# EAGLE design ring-modulator-v2.0 (EAGLE 9.5.2)
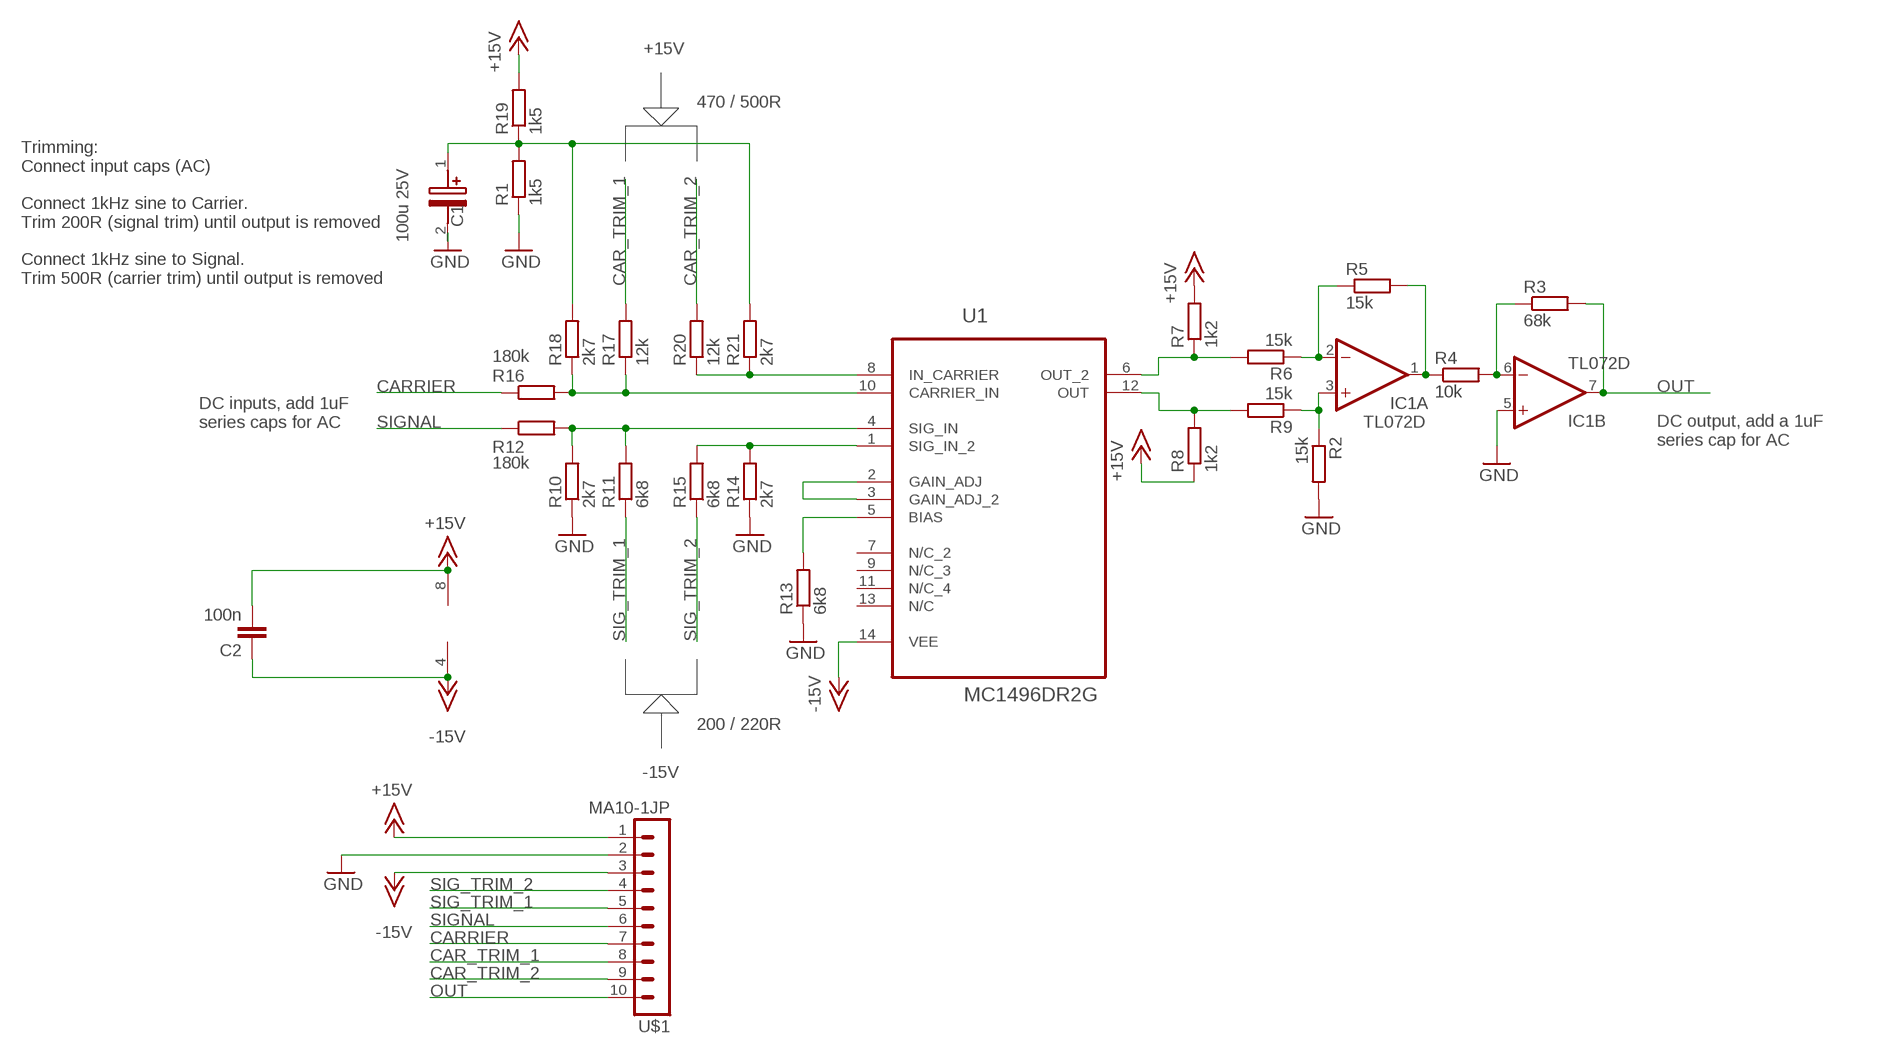
[diagram p0: schematic, sheet 1]

## Parts
C1  100u 25V  VZL101M1CTR-0606  [CAPAE660X610N]
C2  100n  C-EUC0603  [C0603]
IC1  TL072D  [SO08J]
R1  1k5  R-EU_R0805  [R0805]
R2  15k  R-EU_R0805  [R0805]
R3  68k  R-EU_R0805  [R0805]
R4  10k  R-EU_R0805  [R0805]
R5  15k  R-EU_R0805  [R0805]
R6  15k  R-EU_R0805  [R0805]
R7  1k2  R-EU_R0805  [R0805]
R8  1k2  R-EU_R0805  [R0805]
R9  15k  R-EU_R0805  [R0805]
R10  2k7  R-EU_R0805  [R0805]
R11  6k8  R-EU_R0805  [R0805]
R12  180k  R-EU_R0805  [R0805]
R13  6k8  R-EU_R0805  [R0805]
R14  2k7  R-EU_R0805  [R0805]
R15  6k8  R-EU_R0805  [R0805]
R16  180k  R-EU_R0805  [R0805]
R17  12k  R-EU_R0805  [R0805]
R18  2k7  R-EU_R0805  [R0805]
R19  1k5  R-EU_R0805  [R0805]
R20  12k  R-EU_R0805  [R0805]
R21  2k7  R-EU_R0805  [R0805]
U1  MC1496DR2G  [SOIC127P600X175-14N]
U$1  MA10-1JP  [SIP-PIN10-1J]

## Nets
+15V: C2.2 IC1.8(P:V+) R7.2 R8.1 R19.2 U$1.1
-15V: C2.1 IC1.4(P:V-) U1.14(VEE) U$1.3
CAR_TRIM_1: R17.2 U$1.8
CAR_TRIM_2: R20.2 U$1.9
CARRIER: R16.1 U$1.7
GND: C1.2(-) IC1.5(B:+IN) R1.1 R2.2 R10.1 R13.1 R14.1 U$1.2
N$1: R10.2 R11.2 R12.2 U1.4(SIG_IN)
N$2: R16.2 R17.1 R18.1 U1.10(CARRIER_IN)
N$3: R14.2 R15.2 U1.1(SIG_IN_2)
N$8: R20.1 R21.1 U1.8(IN_CARRIER)
N$9: C1.1(+) R1.2 R18.2 R19.1 R21.2
N$11: R13.2 U1.5(BIAS)
N$12: U1.2(GAIN_ADJ) U1.3(GAIN_ADJ_2)
N$13: R6.2 R7.1 U1.6(OUT_2)
N$14: R8.2 R9.2 U1.12(OUT)
N$15: IC1.3(A:+IN) R2.1 R9.1
N$16: IC1.2(A:-IN) R5.1 R6.1
N$17: IC1.1(A:OUT) R4.1 R5.2
N$18: IC1.6(B:-IN) R3.1 R4.2
OUT: IC1.7(B:OUT) R3.2 U$1.10
SIG_TRIM_1: R11.1 U$1.5
SIG_TRIM_2: R15.1 U$1.4
SIGNAL: R12.1 U$1.6
Unconnected: U1.7(N/C_2) U1.9(N/C_3) U1.11(N/C_4) U1.13(N/C)

## Notes on the sheet
- +15V
- 470 / 500R
- Trimming:
  Connect input caps (AC)
  
  Connect 1kHz sine to Carrier. 
  Trim 200R (signal trim) until output is removed
  
  Connect 1kHz sine to Signal. 
  Trim 500R (carrier trim) until output is removed
- DC inputs, add 1uF 
  series caps for AC
- DC output, add a 1uF 
  series cap for AC
- 200 / 220R
- -15V

## Library data of the parts
C1 = joakim-jclpcb:VZL101M1CTR-0606: Aluminum Electrolytic Capacitors - SMD 100uF 16 Volts 20% Source: Datasheet <https://www.mouser.com/datasheet/2/231/151002386372-1222327.pdf>; DESCRIPTION: Aluminum Electrolytic Capacitors - SMD 100uF 16 Volts 20%; HEIGHT: 6.1mm; MANUFACTURER_NAME: Lelon; MANUFACTURER_PART_NUMBER: VZL101M1CTR-0606; MOUSER_PART_NUMBER: 140-VZL101M1CTR-0606; MOUSER_PRICE-STOCK: https://www.mouser.com/Search/Refine.aspx?Keyword=140-VZL101M1CTR-0606
C2 = rcl:C-EU: CAPACITOR, European symbol; SPICEPREFIX: C
IC1 = joakim:TL072: OP AMP
R1-R21 = resistor:R-EU_: RESISTOR, European symbol
U1 = ON Semiconductor_By_element14_Batch_1:MC1496DR2G: Balanced Modulators/Demodulators; MPN: MC1496DR2G; OC_FARNELL: 1651904; OC_NEWARK: 45J1148; PACKAGE: SOIC-14; SUPPLIER: ON SEMICONDUCTOR
U$1 = joakim:MA10-1J

## Board
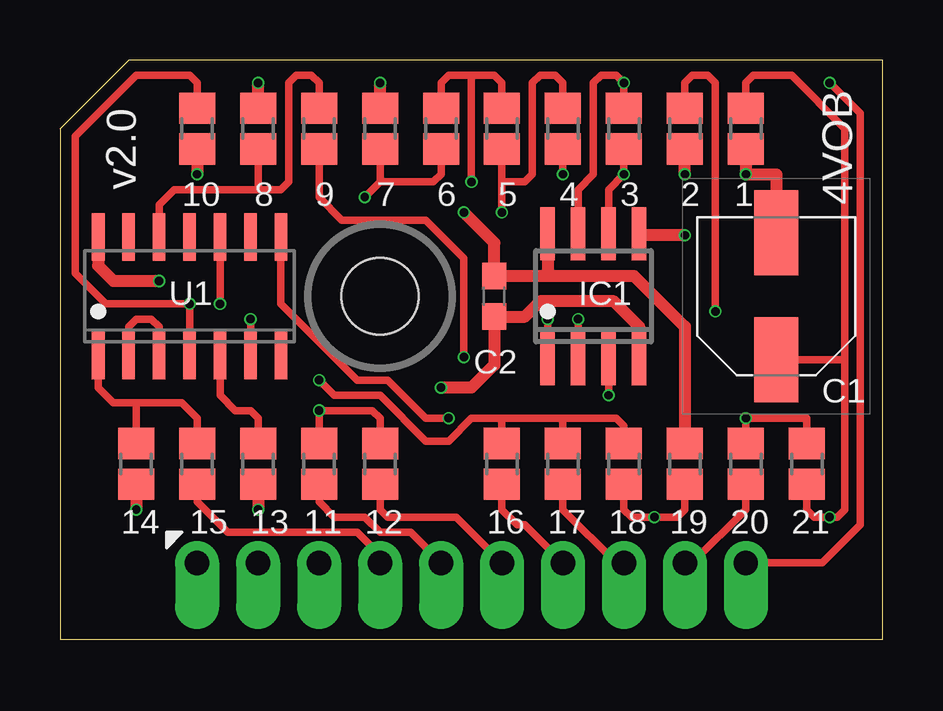
[diagram p1: board, top side]
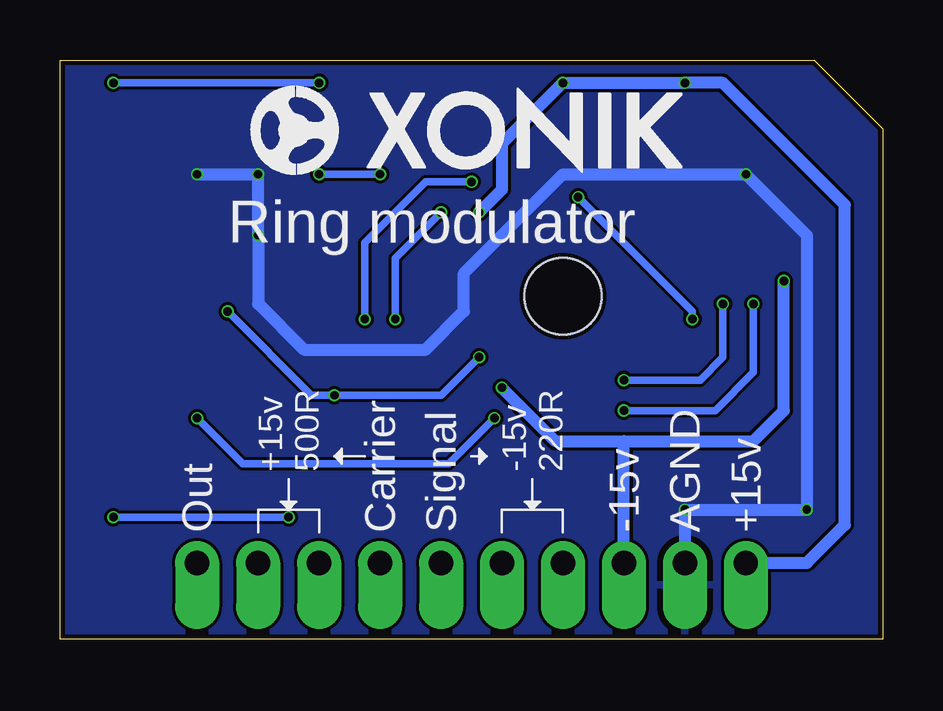
[diagram p2: board, bottom side, seen from below]

Size 34.29 x 24.13 mm. Coordinates in mm from the lower left corner, seen from the top.
Outline: 0,0 34.29,0 34.29,24.13 2.86,24.13 0,21.27 0,0
Copper layers (1*16): Top 0.035mm / dielectric 1.6mm / Bottom 0.035mm
Design rules "jlcpcb-2layers": minimum track width 5mil, minimum drill 0.3mm, track to track 5mil, track to pad 5mil, pad to pad 5mil, via to via 5mil, smd to smd 5mil, copper to edge 0.2mm, drill to drill 6mil, minimum pad ring 10mil, minimum via ring 3mil, stop-mask expansion 4mil, vias tented up to drill 0mil, thermal gap 10mil
Holes 3.2 mm at 13.34,14.29

### Footprints (pad centres in the part's own frame; a part is rotated, then mirrored left to right if it is on the bottom)
CAPAE660X610N = smd 3.55 x 1.85: 1 -2.65,0; 2 2.65,0
C0603 = smd 1.1 x 1: 1 -0.85,0; 2 0.85,0
SO08J = smd 0.6 x 2.2: 1 -1.905,-2.6; 2 -0.635,-2.6; 3 0.635,-2.6; 4 1.905,-2.6; 5 1.905,2.6; 6 0.635,2.6; 7 -0.635,2.6; 8 -1.905,2.6
R0805 = smd 1.3 x 1.5: 1 -0.85,0; 2 0.85,0
SOIC127P600X175-14N = smd 1.981 x 0.533: 1 -2.464,3.81; 2 -2.464,2.54; 3 -2.464,1.27; 4 -2.464,0; 5 -2.464,-1.27; 6 -2.464,-2.54; 7 -2.464,-3.81; 8 2.464,-3.81; 9 2.464,-2.54; 10 2.464,-1.27; 11 2.464,0; 12 2.464,1.27; 13 2.464,2.54; 14 2.464,3.81
SIP-PIN10-1J = drill 1.016 offset: 1 -11.43,0; 2 -8.89,0; 3 -6.35,0; 4 -3.81,0; 5 -1.27,0; 6 1.27,0; 7 3.81,0; 8 6.35,0; 9 8.89,0; 10 11.43,0

### Placement (x,y rotation side)
C1  29.84,14.29 90 top
C2  18.1,14.29 90 top
IC1  22.23,14.29 0 top
R1  28.57,21.27 90 top
R2  26.04,21.27 270 top
R3  23.5,21.27 90 top
R4  20.95,21.27 270 top
R5  18.41,21.27 270 top
R6  15.88,21.27 270 top
R7  13.34,21.27 90 top
R8  8.26,21.27 270 top
R9  10.79,21.27 90 top
R10  5.71,21.27 90 top
R11  10.79,7.3 90 top
R12  13.34,7.3 90 top
R13  8.26,7.3 90 top
R14  3.17,7.3 90 top
R15  5.71,7.3 90 top
R16  18.41,7.3 90 top
R17  20.95,7.3 270 top
R18  23.5,7.3 270 top
R19  26.04,7.3 90 top
R20  28.57,7.3 270 top
R21  31.11,7.3 270 top
U1  5.4,14.29 90 top
U$1  17.14,3.17 0 top
U$3  [XONIK_LOGO_18]  26.35,19.37 0 bottom

### Tracks (layer width: path | path; a pad name or v marks a point on that pad's centre or on a via)
+15V  (via drill 0.35)
  Top 0.508: R19.2 26.04,13.02 23.91,15.14 20.32,15.14 | R8.1 v8.26,23.18 | R7.2 v13.34,23.18 | 20.32,15.14 C2.2 18.1,16.51 v16.83,17.78 | IC1.8 20.32,15.14
  Bottom 0.508: U$1.1 3.17,3.17 1.59,4.76 1.59,18.1 6.67,23.18 v8.26,23.18 v13.34,23.18 15.88,20.64 15.88,18.73 v16.83,17.78
-15V  (via drill 0.35)
  Top 0.508: U1.14 1.59,15.56 2.22,14.92 v4.13,14.92 | IC1.4 24.13,13.02 23.07,14.07 20,14.07 19.37,13.44 C2.1 18.1,11.43 17.14,10.48 v15.88,10.48
  Bottom 0.508: U$1.3 10.79,8.26 | v4.13,14.92 4.13,9.53 5.4,8.26 10.79,8.26 | v15.88,10.48 13.65,8.26 10.79,8.26
CAR_TRIM_1
  Top 0.305: R17.2 20.95,5.4 23.18,3.17 U$1.8
CAR_TRIM_2
  Top 0.305: R20.2 28.57,5.4 26.35,3.17 U$1.9
CARRIER
  Top 0.305: R16.1 18.41,5.4 19.05,4.76 19.37,4.76 U$1.7
GND  (via drill 0.35)
  Top 0.508: v26.04,16.83 24.19,16.83 IC1.5 | R14.1 v3.17,5.4 | R13.1 v8.26,5.4 | R10.1 v5.71,19.37 | v26.04,19.37 R2.2 | R1.1 v28.57,19.37 29.84,19.37 C1.2
  Bottom 0.508: U$1.2 v8.26,5.4 v3.17,5.4 3.17,16.83 v5.71,19.37 13.34,19.37 17.46,15.24 17.46,13.65 19.05,12.06 24.13,12.06 26.04,13.97 v26.04,16.83 v26.04,19.37 v28.57,19.37
  pour Bottom: 34.29,24.13 0,24.13 0,0 34.29,0
N$1  (via drill 0.35)
  Top 0.305: R11.2 v10.79,9.53 13.02,9.53 13.34,9.21 R12.2 | U1.4 v5.4,13.97 1.91,13.97 0.64,15.24 0.64,20.95 3.17,23.5 5.4,23.5 5.71,23.18 R10.2
  Bottom 0.305: v5.4,13.97 5.4,11.11 6.99,9.53 v10.79,9.53
N$2  (via drill 0.35)
  Top 0.305: 18.41,9.21 R16.2 | 18.41,9.21 20.95,9.21 | R17.1 20.95,9.21 | 18.41,9.21 17.14,9.21 16.19,8.26 15.24,8.26 13.34,10.16 11.43,10.16 v10.79,10.79 | R18.1 23.5,8.89 23.18,9.21 20.95,9.21 | U1.10 v6.67,13.97
  Bottom 0.305: v6.67,13.97 6.67,11.75 7.62,10.79 v10.79,10.79
N$3
  Top 0.305: U1.1 1.59,10.48 2.22,9.84 3.17,9.84 | 3.17,9.84 5.08,9.84 5.71,9.21 R15.2 | R14.2 3.17,9.84
N$8  (via drill 0.35)
  Top 0.305: U1.8 9.21,13.97 12.38,10.79 13.65,10.79 15.24,9.21 v16.19,9.21 | R20.1 v28.57,9.21 31.11,9.21 R21.1
  Bottom 0.305: v28.57,9.21 26.67,7.3 18.1,7.3 v16.19,9.21
N$9  (via drill 0.35)
  Top 0.305: 32.7,11.75 32.7,5.4 32.38,5.08 v32.07,5.08 31.43,5.08 31.11,5.4 R21.2 | 32.7,11.75 32.7,21.27 30.48,23.5 28.89,23.5 28.57,23.18 R1.2 | 32.7,11.75 32.59,11.64 C1.1 | R18.2 23.5,5.4 23.81,5.08 v24.77,5.08 25.72,5.08 26.04,5.4 R19.1
  Bottom 0.305: v32.07,5.08 v24.77,5.08
N$11
  Top 0.305: U1.5 6.67,10.16 7.3,9.53 7.94,9.53 8.26,9.21 R13.2
N$12
  Top 0.305: U1.2 2.86,13.02 3.17,13.34 3.81,13.34 4.13,13.02 U1.3
N$13  (via drill 0.35)
  Top 0.305: U1.6 v7.94,13.34 | 13.34,19.05 v12.7,18.41 | R6.2 15.88,19.37 15.56,19.05 13.34,19.05 | R7.1 13.34,19.05
  Bottom 0.305: v7.94,13.34 7.94,13.65 v12.7,18.41
N$14
  Top 0.305: U1.12 4.13,18.1 4.76,18.73 8.26,18.73 | R9.2 10.79,23.18 10.48,23.5 9.84,23.5 9.53,23.18 9.53,19.05 9.21,18.73 8.26,18.73 | R8.2 8.26,18.73
N$15  (via drill 0.35)
  Top 0.305: R9.1 10.79,18.41 11.75,17.46 15.24,17.46 16.83,15.88 v16.83,11.75 | v27.3,13.65 27.3,23.18 26.99,23.5 26.35,23.5 26.04,23.18 R2.1 | v22.86,10.16 IC1.3
  Bottom 0.305: v27.3,13.65 23.81,10.16 v22.86,10.16 18.41,10.16 v16.83,11.75
N$16  (via drill 0.35)
  Top 0.305: R6.1 15.88,23.18 16.19,23.5 17.14,23.5 | IC1.2 v21.59,13.34 | v17.14,19.05 17.14,23.5 | 17.14,23.5 18.1,23.5 18.41,23.18 R5.1
  Bottom 0.305: v21.59,13.34 21.59,16.51 19.05,19.05 v17.14,19.05
N$17  (via drill 0.35)
  Top 0.305: IC1.1 v20.32,13.34 | v18.41,17.78 18.41,19.05 | 18.41,19.05 R5.2 | R4.1 20.95,23.18 20.64,23.5 20,23.5 19.68,23.18 19.68,19.37 19.37,19.05 18.41,19.05
  Bottom 0.305: v20.32,13.34 20.32,15.88 v18.41,17.78
N$18  (via drill 0.35)
  Top 0.305: R3.1 v23.5,19.37 22.86,18.73 IC1.6 | R4.2 v20.95,19.37
  Bottom 0.305: v20.95,19.37 v23.5,19.37
OUT  (via drill 0.35)
  Top 0.305: U$1.10 31.75,3.17 33.34,4.76 33.34,21.91 v32.07,23.18 | IC1.7 21.59,18.73 22.23,19.37 22.23,23.18 22.54,23.5 23.18,23.5 v23.5,23.18 R3.2
  Bottom 0.305: v32.07,23.18 v23.5,23.18
SIG_TRIM_1
  Top 0.305: R11.1 10.79,5.71 11.43,5.08 12.7,5.08 13.34,4.45 14.61,4.45 U$1.5
SIG_TRIM_2
  Top 0.305: R15.1 5.71,5.71 6.99,4.45 12.38,4.45 13.34,3.49 U$1.4
SIGNAL
  Top 0.305: U$1.6 16.51,5.08 13.65,5.08 13.34,5.4 R12.1

### Text on the board
tNames: v2.0 | 10 | 8 | 9 | 7 | 6 | 5 | 4 | 3 | 2 | 1 | 4VOB | U1 | IC1 | C2 | C1 | 14 | 15 | 13 | 11 | 12 | 16 | 17 | 18 | 19 | 20 | 21
bNames: Ring modulator | -15v / 220R | +15v / 500R | +15v | AGND | -15v | Signal | Carrier | Out